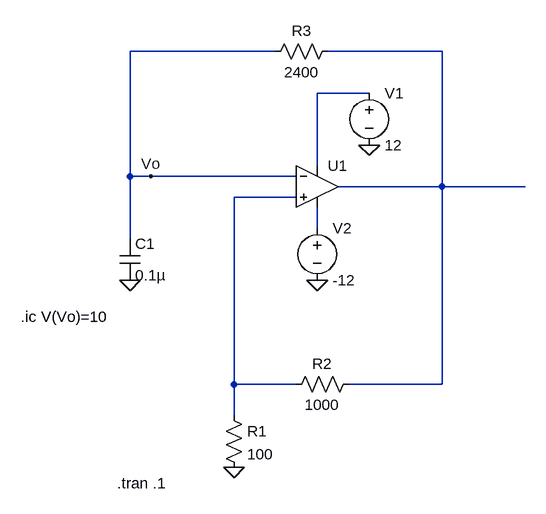
[diagram p0: schematic squaregenerator.asc]
squaregenerator.asc, the LTspice schematic file:
Version 4
SHEET 1 1156 680
WIRE 192 -48 -32 -48
WIRE 448 -48 272 -48
WIRE 336 16 256 16
WIRE 256 128 256 16
WIRE -32 144 -32 -48
WIRE 0 144 -32 144
WIRE 224 144 0 144
WIRE 448 160 448 -48
WIRE 448 160 288 160
WIRE 576 160 448 160
WIRE 224 176 128 176
WIRE 256 224 256 192
WIRE -32 240 -32 144
WIRE 128 464 128 176
WIRE 224 464 128 464
WIRE 448 464 448 160
WIRE 448 464 304 464
WIRE 128 512 128 464
FLAG 336 96 0
FLAG 256 304 0
FLAG -32 304 0
FLAG 128 592 0
FLAG 0 144 Vo
SYMBOL res 112 496 R0
SYMATTR InstName R1
SYMATTR Value 100
SYMBOL res 320 448 R90
WINDOW 0 0 56 VBottom 2
WINDOW 3 32 56 VTop 2
SYMATTR InstName R2
SYMATTR Value 1000
SYMBOL cap -48 240 R0
SYMATTR InstName C1
SYMATTR Value 0.1µ
SYMBOL res 288 -64 R90
WINDOW 0 0 56 VBottom 2
WINDOW 3 32 56 VTop 2
SYMATTR InstName R3
SYMATTR Value 2400
SYMBOL voltage 336 0 R0
WINDOW 123 0 0 Left 2
WINDOW 39 0 0 Left 2
SYMATTR InstName V1
SYMATTR Value 12
SYMBOL voltage 256 208 R0
WINDOW 123 0 0 Left 2
WINDOW 39 0 0 Left 2
SYMATTR InstName V2
SYMATTR Value -12
SYMBOL Opamps\\UniversalOpamp2 256 160 R0
SYMATTR InstName U1
TEXT -52 616 Left 2 !.tran .1
TEXT -200 360 Left 2 !.ic V(Vo)=10

The netlist it stands for:
* squaregenerator.asc
R1 N003 0 100
R2 N001 N003 1000
C1 Vo 0 0.1µ
R3 N001 Vo 2400
V1 N002 0 12
V2 N004 0 -12
XU1 N003 Vo N002 N004 N001 level.2 Avol=1Meg GBW=10Meg Slew=10Meg ilimit=25m rail=0 Vos=0 phimargin=45 en=0 enk=0 in=0 ink=0 Rin=500Meg  ; pins IN+ IN- V+ V- OUT
.tran .1
.ic V(Vo)=10
.lib UniversalOpamps2.sub
.backanno
.end